# Altium schematic sheet Mikrobus_v2.SchDoc
size A4; SheetNumber: 2; SheetTotal: 2
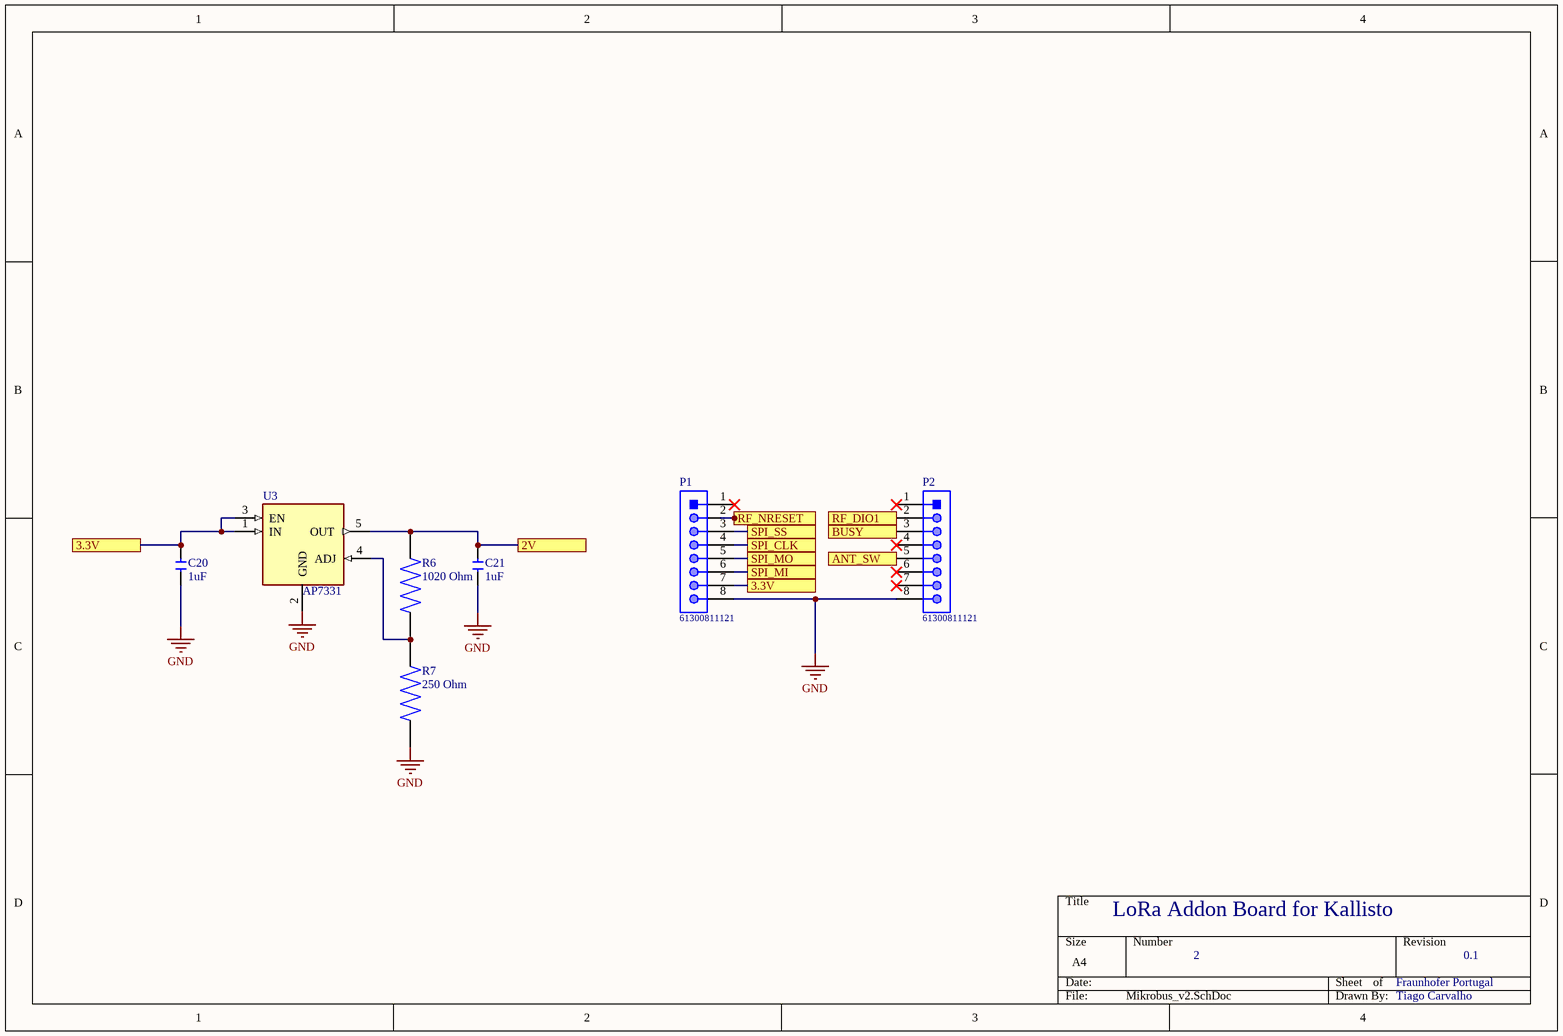
[diagram p0: Mikrobus_v2.SchDoc]

## Parts
C20  1uF  [C0402]
C21  1uF  [C0402]
P1  61300811121  [61300811121]
P2  61300811121  [61300811121]
R6  1020 Ohm  [RESC1005X40N]
R7  250 Ohm  [RESC1005X35N]
U3  AP7331  [SOT95P285X145-5N]

## Ports
2V, 3.3V, ANT_SW, BUSY, RF_DIO1, RF_NRESET, SPI_CLK, SPI_MI, SPI_MO, SPI_SS

## Nets
GND: C20.1 C21.1 P1.8 P2.8 R7.1 U3.2(GND)
2V: C21.2 R6.2 U3.5(OUT) ; port 2V
3.3V: C20.2 P1.7 U3.1(IN) U3.3(EN) ; port 3.3V
ANT_SW: P2.5 ; port ANT_SW
BUSY: P2.3 ; port BUSY
RF_DIO1: P2.2 ; port RF_DIO1
RF_NRESET: P1.2 ; port RF_NRESET
SPI_CLK: P1.4 ; port SPI_CLK
SPI_MI: P1.6 ; port SPI_MI
SPI_MO: P1.5 ; port SPI_MO
SPI_SS: P1.3 ; port SPI_SS
NetR6_1: R6.1 R7.2 U3.4(ADJ)

Not connected (* = marked no-connect by the designer): P1 1*; P2 1* 4* 6* 7*

## Notes on the sheet
- LoRa Addon Board for Kallisto
- 2
- Fraunhofer Portugal
- 0.1
- Tiago Carvalho

## Library data of the parts
C20 C21 = CERAMIC-1UF-10V-10%-X5R(0402): 1ÂµF Â±10% 10V Ceramic Capacitor X5R 0402 _1005 Metric_; MP: CC0402KRX5R6BB105; MF: Yageo; Value: 1uF; Package: 0402 Yageo; SnapEDA_Link: https://www.snapeda.com/parts/CC0402KRX5R6BB105/Yageo/view-part/105546/?ref=snap; Price: None; Availability: Unavailable
P1 P2 = CMP-1502-01076-1: THT Vertical Pin Header WR-PHD, Pitch 2.54 mm, Single Row, 8 pins; Manufacturer: Wurth Elektronik; Rated Current: 3A; Pin Number: 8; Working Voltage: 250VAC; Gender: Male; Contact Resistance: 20mOhm; Pitch: 2.54mm; Withstanding Voltage: 500VAC; Publisher: WurthElektronik; Operating Temperature: -40to105degC; Orientation: Vertical; Row Number: Single; Part Number: 61300811121; Package Reference: 61300811121; Mounting Technology: THT; Packaging: Bag; Manufacturer URL: http://www.we-online.de; Datasheet URL: https://katalog.we-online.de/em/datasheet/6130xx11121.pdf
R6 = CRCW04021K02FKTD: Res Thick Film 0402 1.02K Ohm 1% 1/16W Â±100ppm/Â°C Molded SMD SMD Paper T/R; Package: None; Price: None; Value: 1020 Ohm; MP: CRCW04021K02FKTD; Availability: Unavailable
R7 = CRCW0402255RFKEDC: Package: None; Price: None; Value: 250 Ohm; MP: CRCW0402255RFKEDC; Availability: Unavailable
U3 = AP7331-18WG-7: Linear Voltage Regulator IC 1 Output 300mA SOT-25; MF: Diodes Inc.; MP: AP7331-18WG-7; Package: SOT-753 Diodes Inc.; Availability: Unavailable; Price: None; SnapEDA_Link: https://www.snapeda.com/parts/AP7331-18WG-7/Diodes%20Inc./view-part/494406/?ref=snap; Value: *